# Altium schematic sheet Gastroscopy-LED_Overview.SchDoc: Overview
size 279 x 215 mm; Date: not used; ApprovedBy: not used; CheckedBy: not used; Author: not used; DrawnBy: not used; Organization: not used; Address4: not used; SheetNumber: 2; SheetTotal: 3; Time: not used; ImagePath: not used; Application_BuildNumber: not used
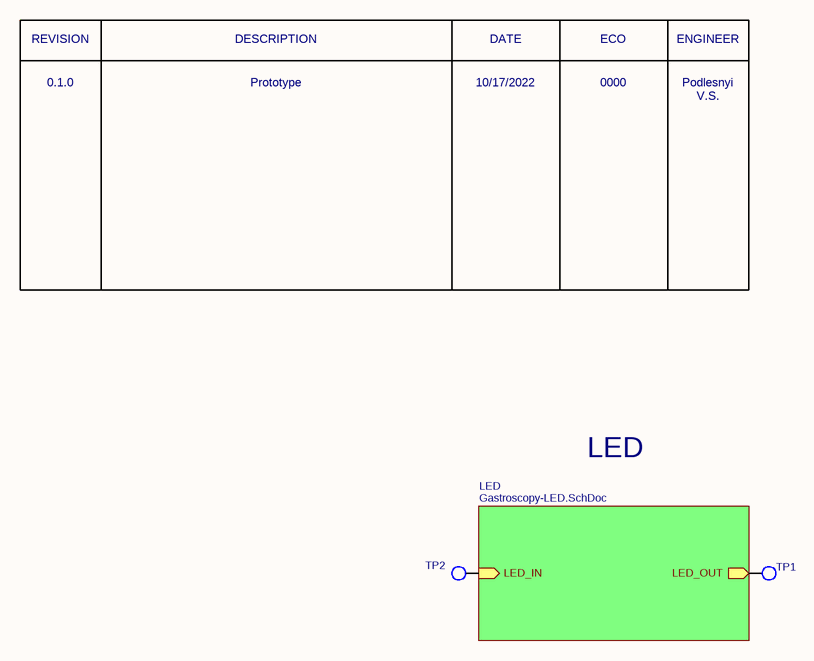
[diagram p0: Gastroscopy-LED_Overview.SchDoc]

## Parts
TP1  TEST_POINT_SMT  [TEST_POINT_SMT]  (value not drawn)  (no BOM)
TP2  TEST_POINT_SMT  [TEST_POINT_SMT]  (value not drawn)  (no BOM)

## Sub-sheets
LED = Gastroscopy-LED.SchDoc: LED_IN (in), LED_OUT (out)

## Nets
NetTP1_1: TP1.1 ; sheet LED/LED_OUT
NetTP2_1: TP2.1 ; sheet LED/LED_IN

## Notes on the sheet
- REVISION
- DESCRIPTION
- DATE
- ECO
- ENGINEER
- 0.1.0
- Prototype
- 10/17/2022
- 0000
- Podlesnyi V.S.
- LED
- Title:
- Date:
- Size A
- Project:
- Number:
- Time:
- Sheet
- Revision
- of
- Engineer:
- www.mrobots.ru <http://mrobots.ru/>
- File:

## Library data of the parts
TP1 TP2 = TEST_POINT_SMT: STM TEST POINT